# Altium schematic sheet Arduino FPGA Design.SchDoc
size A4
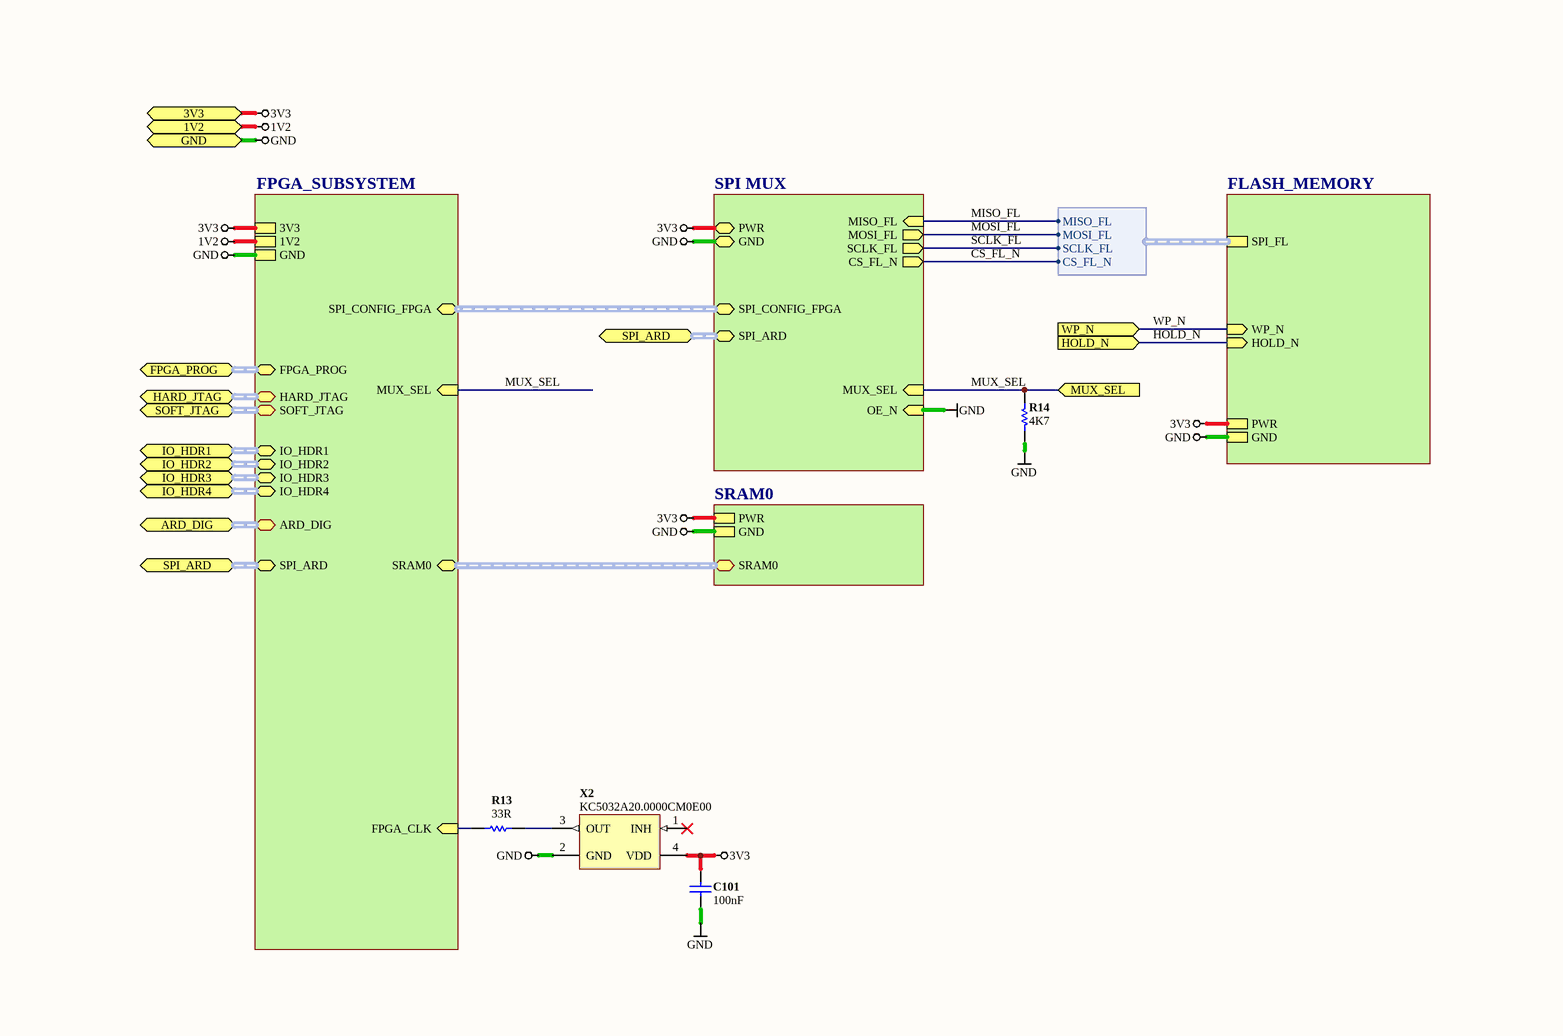
[diagram p0: Arduino FPGA Design.SchDoc]

## Parts
C101  value 100nF  [CAPC0402(1005)60_L]  (hidden comment: CAP 100nF 16V 0402(1005))
R13  value 33R  [RESC0402(1005)40_L]  (hidden comment: 33R 1 0402)
R14  value 4K7  [RESC0402(1005)40_L]  (hidden comment: 4K7 1 0402)
X2  KC5032A20.0000CM0E00  [HOSC-L500HW320H105-4_2]

## Sub-sheets
FLASH_MEMORY = Flash - S25FL216K0PMFI041.SchDoc: SPI_FL (harness SPI_FLASH), PWR, WP_N (in), HOLD_N (in), GND
FPGA_SUBSYSTEM = FPGA - XC6SLX9-2TQG144C.schdoc: 3V3, GND, 1V2, FPGA_CLK (in), HARD_JTAG (harness HARD_JTAG), SOFT_JTAG (harness SOFT_JTAG), IO_HDR3 (harness IO_HDR3), IO_HDR4 (harness IO_HDR4), SPI_CONFIG_FPGA (harness SPI_CONFIG_FPGA), FPGA_PROG (harness FPGA_PROGRAM), IO_HDR1 (harness IO_HDR1), IO_HDR2 (harness IO_HDR2), SRAM0 (harness SRAM0), ARD_DIG (harness ARDUINO_DIGITAL), SPI_ARD (harness SPI_ARD), MUX_SEL (in)
SPI MUX = Arduino FPGA SPI MUX.SchDoc: MISO_FL (in), MOSI_FL (out), SCLK_FL (out), CS_FL_N (out), OE_N (in), MUX_SEL (in), SPI_CONFIG_FPGA (harness SPI_CONFIG_FPGA), PWR, GND, SPI_ARD (harness SPI_ARD)
SRAM0 = SRAM0 - IS61WV12816DBLL-10BLI.SchDoc: PWR, GND, SRAM0 (harness SRAM0)

## Ports
1V2, 3V3, ARD_DIG (harness ARDUINO_DIGITAL), FPGA_PROG (harness FPGA_PROGRAM), GND, HARD_JTAG (harness HARD_JTAG), HOLD_N (in), IO_HDR1 (harness IO_HDR1), IO_HDR2 (harness IO_HDR2), IO_HDR3 (harness IO_HDR3), IO_HDR4 (harness IO_HDR4), MUX_SEL (in), SOFT_JTAG (harness SOFT_JTAG), SPI_ARD (harness SPI_ARD), WP_N (in)

## Harnesses
SPI_FLASH: MOSI_FL, MISO_FL, SCLK_FL, CS_FL_N

## Nets
1V2: port 1V2, sheet FPGA_SUBSYSTEM/1V2
3V3: C101.1 X2.4(VDD) ; port 3V3, sheet FLASH_MEMORY/PWR, sheet FPGA_SUBSYSTEM/3V3, sheet SPI MUX/PWR, sheet SRAM0/PWR
GND: C101.2 R14.1 X2.2(GND) ; port GND, sheet FLASH_MEMORY/GND, sheet FPGA_SUBSYSTEM/GND, sheet SPI MUX/OE_N, sheet SPI MUX/GND, sheet SRAM0/GND
CS_FL_N: sheet SPI MUX/CS_FL_N, sheet FLASH_MEMORY/SPI_FL.CS_FL_N
HOLD_N: port HOLD_N, sheet FLASH_MEMORY/HOLD_N
MISO_FL: sheet SPI MUX/MISO_FL, sheet FLASH_MEMORY/SPI_FL.MISO_FL
MOSI_FL: sheet SPI MUX/MOSI_FL, sheet FLASH_MEMORY/SPI_FL.MOSI_FL
MUX_SEL: R14.2 ; port MUX_SEL, sheet FPGA_SUBSYSTEM/MUX_SEL, sheet SPI MUX/MUX_SEL
SCLK_FL: sheet SPI MUX/SCLK_FL, sheet FLASH_MEMORY/SPI_FL.SCLK_FL
WP_N: port WP_N, sheet FLASH_MEMORY/WP_N
NetR13_1: R13.1 ; sheet FPGA_SUBSYSTEM/FPGA_CLK
NetR13_2: R13.2 X2.3(OUT)

Not connected (* = marked no-connect by the designer): X2 1(INH)*

## Buses and harness runs
harness port ARD_DIG = sheet FPGA_SUBSYSTEM/ARD_DIG
harness port FPGA_PROG = sheet FPGA_SUBSYSTEM/FPGA_PROG
harness port HARD_JTAG = sheet FPGA_SUBSYSTEM/HARD_JTAG
harness port IO_HDR1 = sheet FPGA_SUBSYSTEM/IO_HDR1
harness port IO_HDR2 = sheet FPGA_SUBSYSTEM/IO_HDR2
harness port IO_HDR3 = sheet FPGA_SUBSYSTEM/IO_HDR3
harness port IO_HDR4 = sheet FPGA_SUBSYSTEM/IO_HDR4
harness port SOFT_JTAG = sheet FPGA_SUBSYSTEM/SOFT_JTAG
harness port SPI_ARD = sheet FPGA_SUBSYSTEM/SPI_ARD
harness port SPI_ARD = sheet SPI MUX/SPI_ARD
harness sheet FPGA_SUBSYSTEM/SPI_CONFIG_FPGA = sheet SPI MUX/SPI_CONFIG_FPGA
harness sheet FPGA_SUBSYSTEM/SRAM0 = sheet SRAM0/SRAM0

## Library data of the parts
C101 = CAP 100nF 16V ±10% 0402 (1005 Metric) Thickness 0.6mm SMD: Case-EIA: 0402; Case-Metric: 1005; Tolerance: ±10%; Max Thickness: 0.6 mm; Rated Voltage: 16 V; Technology: SMT
R13 = 0402 (1005 Metric) 1/16 W 33R 1 Thick Film Chip Resistor: Case-EIA: 0402; Case-Metric: 1005; Temp Coefficient ppm/°C: ±100; Tolerance %: 1%; Value (Ohms): 33; Power: 1/16 W; Technology: SMT
R14 = 0402 (1005 Metric) 1/16 W 4K7 1 Thick Film Chip Resistor: Case-EIA: 0402; Case-Metric: 1005; Power: 1/16 W; Temp Coefficient ppm/°C: ±100; Tolerance %: 1%; Value (Ohms): 4700; Technology: SMT
X2 = OSCILLATOR 20.0000MHZ SMD: PartNumber: HCX-C2-20M; DefaultDesignator: X?; Class: Oscillators; Frequency: 20.00 MHZ; Output: CMOS; Supply Voltage: 3V3, 5V0; ComponentLink1Description: Datasheet; ComponentLink1URL: http://www.hongkongcrystal.com/upload/product/original/347881837473.pdf; ComponentLink2Description: Manufacturer; ComponentLink2URL: http://global.kyocera.com/; Type: XO (Standard)